# Altium schematic sheet Display.SchDoc: =SheetTitle
size A4; CompanyName: Catcatcat Electronics; Engineer: Hena Chernov; SheetNumber: 8; SheetTotal: 10; CodePhone: +380505759863; SheetDescription: Interactive light feedback module.; Email: catcatcat.electronics@gmail.com
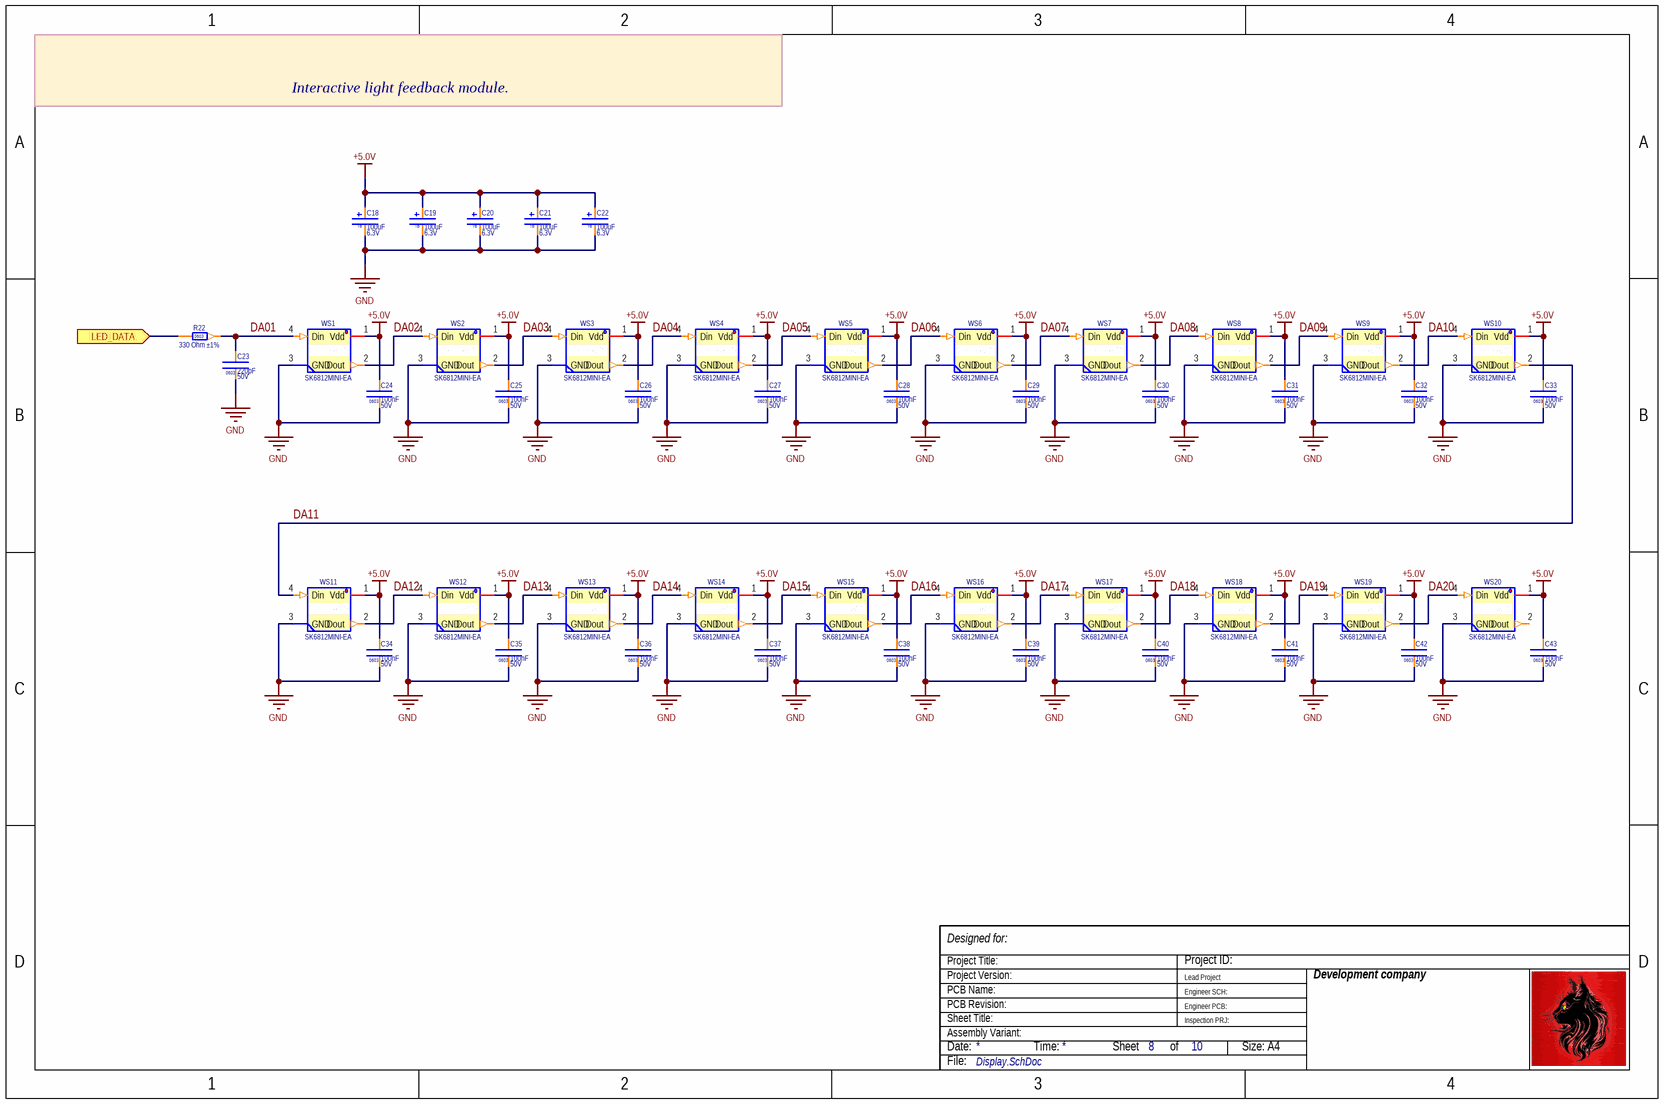
[diagram p0: Display.SchDoc]

## Parts
C18  value 100uF  Voltage: 6.3V  [TANTAL_B]  (hidden comment: 100UF 6.3V CASE-B_3528)
C19  value 100uF  Voltage: 6.3V  [TANTAL_B]  (hidden comment: 100UF 6.3V CASE-B_3528)
C20  value 100uF  Voltage: 6.3V  [TANTAL_B]  (hidden comment: 100UF 6.3V CASE-B_3528)
C21  value 100uF  Voltage: 6.3V  [TANTAL_B]  (hidden comment: 100UF 6.3V CASE-B_3528)
C22  value 100uF  Voltage: 6.3V  [TANTAL_B]  (hidden comment: 100UF 6.3V CASE-B_3528)
C23  value 220pF  Voltage: 50V  [CC0603(1608)x0.8]  (hidden comment: 220 pF ±10%)
C24  value 100nF  Voltage: 50V  [CC0603(1608)x0.8]  (hidden comment: 100 nF ±10% 50V)
C25  value 100nF  Voltage: 50V  [CC0603(1608)x0.8]  (hidden comment: 100 nF ±10% 50V)
C26  value 100nF  Voltage: 50V  [CC0603(1608)x0.8]  (hidden comment: 100 nF ±10% 50V)
C27  value 100nF  Voltage: 50V  [CC0603(1608)x0.8]  (hidden comment: 100 nF ±10% 50V)
C28  value 100nF  Voltage: 50V  [CC0603(1608)x0.8]  (hidden comment: 100 nF ±10% 50V)
C29  value 100nF  Voltage: 50V  [CC0603(1608)x0.8]  (hidden comment: 100 nF ±10% 50V)
C30  value 100nF  Voltage: 50V  [CC0603(1608)x0.8]  (hidden comment: 100 nF ±10% 50V)
C31  value 100nF  Voltage: 50V  [CC0603(1608)x0.8]  (hidden comment: 100 nF ±10% 50V)
C32  value 100nF  Voltage: 50V  [CC0603(1608)x0.8]  (hidden comment: 100 nF ±10% 50V)
C33  value 100nF  Voltage: 50V  [CC0603(1608)x0.8]  (hidden comment: 100 nF ±10% 50V)
C34  value 100nF  Voltage: 50V  [CC0603(1608)x0.8]  (hidden comment: 100 nF ±10% 50V)
C35  value 100nF  Voltage: 50V  [CC0603(1608)x0.8]  (hidden comment: 100 nF ±10% 50V)
C36  value 100nF  Voltage: 50V  [CC0603(1608)x0.8]  (hidden comment: 100 nF ±10% 50V)
C37  value 100nF  Voltage: 50V  [CC0603(1608)x0.8]  (hidden comment: 100 nF ±10% 50V)
C38  value 100nF  Voltage: 50V  [CC0603(1608)x0.8]  (hidden comment: 100 nF ±10% 50V)
C39  value 100nF  Voltage: 50V  [CC0603(1608)x0.8]  (hidden comment: 100 nF ±10% 50V)
C40  value 100nF  Voltage: 50V  [CC0603(1608)x0.8]  (hidden comment: 100 nF ±10% 50V)
C41  value 100nF  Voltage: 50V  [CC0603(1608)x0.8]  (hidden comment: 100 nF ±10% 50V)
C42  value 100nF  Voltage: 50V  [CC0603(1608)x0.8]  (hidden comment: 100 nF ±10% 50V)
C43  value 100nF  Voltage: 50V  [CC0603(1608)x0.8]  (hidden comment: 100 nF ±10% 50V)
R22  value 330 Ohm ±1%  [RC0603(1608) -1%]  (hidden comment: 330 R ±1%)
WS1  SK6812MINI-EA  [SK6812MINI-EA - 1MM]
WS2  SK6812MINI-EA  [SK6812MINI-EA - 1MM]
WS3  SK6812MINI-EA  [SK6812MINI-EA - 1MM]
WS4  SK6812MINI-EA  [SK6812MINI-EA - 1MM]
WS5  SK6812MINI-EA  [SK6812MINI-EA - 1MM]
WS6  SK6812MINI-EA  [SK6812MINI-EA - 1MM]
WS7  SK6812MINI-EA  [SK6812MINI-EA - 1MM]
WS8  SK6812MINI-EA  [SK6812MINI-EA - 1MM]
WS9  SK6812MINI-EA  [SK6812MINI-EA - 1MM]
WS10  SK6812MINI-EA  [SK6812MINI-EA - 1MM]
WS11  SK6812MINI-EA  [SK6812MINI-EA - 1MM]
WS12  SK6812MINI-EA  [SK6812MINI-EA - 1MM]
WS13  SK6812MINI-EA  [SK6812MINI-EA - 1MM]
WS14  SK6812MINI-EA  [SK6812MINI-EA - 1MM]
WS15  SK6812MINI-EA  [SK6812MINI-EA - 1MM]
WS16  SK6812MINI-EA  [SK6812MINI-EA - 1MM]
WS17  SK6812MINI-EA  [SK6812MINI-EA - 1MM]
WS18  SK6812MINI-EA  [SK6812MINI-EA - 1MM]
WS19  SK6812MINI-EA  [SK6812MINI-EA - 1MM]
WS20  SK6812MINI-EA  [SK6812MINI-EA - 1MM]

## Ports
LED_DATA (in)

## Nets
+5.0V: C18.1 C19.1 C20.1 C21.1 C22.1 C24.2 C25.2 C26.2 C27.2 C28.2 C29.2 C30.2 C31.2 C32.2 C33.2 C34.2 C35.2 C36.2 C37.2 C38.2 C39.2 C40.2 C41.2 C42.2 C43.2 WS1.1(Vdd) WS2.1(Vdd) WS3.1(Vdd) WS4.1(Vdd) WS5.1(Vdd) WS6.1(Vdd) WS7.1(Vdd) WS8.1(Vdd) WS9.1(Vdd) WS10.1(Vdd) WS11.1(Vdd) WS12.1(Vdd) WS13.1(Vdd) WS14.1(Vdd) WS15.1(Vdd) WS16.1(Vdd) WS17.1(Vdd) WS18.1(Vdd) WS19.1(Vdd) WS20.1(Vdd)
GND: C18.2 C19.2 C20.2 C21.2 C22.2 C23.1 C24.1 C25.1 C26.1 C27.1 C28.1 C29.1 C30.1 C31.1 C32.1 C33.1 C34.1 C35.1 C36.1 C37.1 C38.1 C39.1 C40.1 C41.1 C42.1 C43.1 WS1.3(GND) WS2.3(GND) WS3.3(GND) WS4.3(GND) WS5.3(GND) WS6.3(GND) WS7.3(GND) WS8.3(GND) WS9.3(GND) WS10.3(GND) WS11.3(GND) WS12.3(GND) WS13.3(GND) WS14.3(GND) WS15.3(GND) WS16.3(GND) WS17.3(GND) WS18.3(GND) WS19.3(GND) WS20.3(GND)
DA01: C23.2 R22.2 WS1.4(Din)
DA02: WS1.2(Dout) WS2.4(Din)
DA03: WS2.2(Dout) WS3.4(Din)
DA04: WS3.2(Dout) WS4.4(Din)
DA05: WS4.2(Dout) WS5.4(Din)
DA06: WS5.2(Dout) WS6.4(Din)
DA07: WS6.2(Dout) WS7.4(Din)
DA08: WS7.2(Dout) WS8.4(Din)
DA09: WS8.2(Dout) WS9.4(Din)
DA10: WS9.2(Dout) WS10.4(Din)
DA11: WS10.2(Dout) WS11.4(Din)
DA12: WS11.2(Dout) WS12.4(Din)
DA13: WS12.2(Dout) WS13.4(Din)
DA14: WS13.2(Dout) WS14.4(Din)
DA15: WS14.2(Dout) WS15.4(Din)
DA16: WS15.2(Dout) WS16.4(Din)
DA17: WS16.2(Dout) WS17.4(Din)
DA18: WS17.2(Dout) WS18.4(Din)
DA19: WS18.2(Dout) WS19.4(Din)
DA20: WS19.2(Dout) WS20.4(Din)
LED_DATA: R22.1 ; port LED_DATA

Not connected (* = marked no-connect by the designer): WS20 2(Dout)

## Notes on the sheet
- Project Title:
- Project Version:
- Designed for:
- Lead Project
- Project ID:
- Development company
- Date:
- PCB Revision:
- PCB Name:
- Sheet Title:
- Assembly Variant:
- Time:
- Sheet
- of
- Engineer SCH:
- Engineer PCB:
- Inspection PRJ:
- Size: A4
- File:
- (in symbol TANTAL-B 100uF 6.3V (B)) TB

## Library data of the parts
C18-C22 = TANTAL-B 100uF 6.3V (B): Tantalum Capacitors 100uF 6.3V CASE-B_3528 RoHS; Manufacturer 1: AVX; Manufacturer Part Number 1: TAJB107K006RNJ; Lifetime @ Temp: 2000Hrs@105℃; Case/Package: CASE-B_3528; Publisher: Catcatcat Electronics; Note: Tantalum Capacitors; HelpURL: https://datasheet.lcsc.com/szlcsc/AVX-TAJB107K006RNJ_C16133.pdf; website developer: http://catcatcat.d-lan.dp.ua/; Detailed Description: Tantalum Capacitors 100uF 6.3V CASE-B_3528 RoHS; Supplier URL 1: https://jlcpcb.com/parts/componentSearch?searchTxt=; Supplier Part Number 1: C16133; Supplier Unit Price 1: 0.1177; Assembly type: Basic Part; Footprint check status: Verified; QuantityElements: 1; Supplier 1: LCSC; MountType: SMD
C23 = 0603 0.000220 uF (B): 220 pF ±10% 50V X7R; Manufacturer 1: Samsung Electro-Mechanics; Manufacturer Part Number 1: CL10B221KB8NNNC; Note: Ceramic Capacitors; Detailed Description: 50V 220pF X7R ±10% 0603  Multilayer Ceramic Capacitors MLCC - SMD/SMT ROHS; Case/Package: 0603; Publisher: Catcatcat Electronics; Tolerance: ±10%; HelpURL: https://datasheet.lcsc.com/lcsc/1810261515_Samsung-Electro-Mechanics-CL10B221KB8NNNC_C1603.pdf; website developer: http://catcatcat.d-lan.dp.ua/; Temperature Coefficient: X7R; Supplier URL 1: https://jlcpcb.com/parts/componentSearch?searchTxt=; Operating Temperature: -55C to +125C; Supplier Part Number 1: C1603; Supplier Unit Price 1: 0.0074; Assembly type: Basic Part; Footprint check status: Verified; QuantityElements: 1; Supplier 1: LCSC; MountType: SMD
C24-C43 = 0603 0.1 uF (B): 100 nF ±10% 50V X7R; Manufacturer 1: YAGEO; Manufacturer Part Number 1: CC0603KRX7R9BB104; Note: Ceramic Capacitors; Detailed Description: 50V 100nF X7R ±10% 0603  Multilayer Ceramic Capacitors MLCC - SMD/SMT ROHS; Case/Package: 0603; Publisher: Catcatcat Electronics; Tolerance: ±10%; HelpURL: https://datasheet.lcsc.com/lcsc/1809301912_YAGEO-CC0603KRX7R9BB104_C14663.pdf; website developer: http://catcatcat.d-lan.dp.ua/; Temperature Coefficient: X7R; Supplier URL 1: https://jlcpcb.com/parts/componentSearch?searchTxt=; Operating Temperature: -55C to +125C; Supplier Part Number 1: C14663; Supplier Unit Price 1: 0.0021; Assembly type: Basic Part; Footprint check status: Verified; QuantityElements: 1; Supplier 1: LCSC; MountType: SMD
R22 = 0603 330 Ohm ±1% (B): 330 R (331) ±5% 1/10W 50V; Manufacturer 1: Uniroyal Elec; Manufacturer Part Number 1: 0603WAF3300T5E; Note: Chip Resistor - Surface Mount; Temperature Coefficient: ±100ppm/°C; Detailed Description: CHIP RESISTOR - SURFACE MOUNT 330OHMS ±1% 1/10W 0603 ROHS; Publisher: Catcatcat Electronics; Tolerance: ±1%; Voltage: 50V; HelpURL: https://datasheet.lcsc.com/szlcsc/Uniroyal-Elec-0603WAF3300T5E_C23138.pdf; Website Developer: http://catcatcat.d-lan.dp.ua/; Power (Watts): 1/10W; Supplier URL 1: https://jlcpcb.com/parts/componentSearch?searchTxt=; Manufacturer URL: http://uniohm.com/; Operating Temperature: -55°C ~ 155°C; Supplier Part Number 1: C23138; Supplier Unit Price 1: 0.0019; Assembly type: Basic Part; Footprint check status: Verified; QuantityElements: 1; Supplier 1: LCSC; MountType: SMD; Case/Package: 0603
WS1-WS20 = SK6812MINI-EA (E): TTB 12mA 5.2V -40℃~+80℃ RGB LEDs(Built-in IC); Manufacturer 1: OPSCO Optoelectronics; Note: IN THE HOLE OF THE PCB; Temp.Characteristic: -40C to +85C; Voltage: +3.7~+5.3V; Detailed Description: 12mA 5.2V -40℃~+80℃ RGB SMD  Light Emitting Diodes (LED) ROHS; Data Protocol: NRZ; Data structure: GRB 24bit; Case/Package: SMD; Publisher: Catcatcat Electronics; Manufacturer Part Number 1: SK6812MINI-EA; Supplier Part Number 1: C5378731; Supplier Unit Price 1: 0.1573; HelpURL: https://datasheet.lcsc.com/lcsc/2304101800_OPSCO-Optoelectronics-SK6812MINI-EA_C5378731.pdf; Website developer: http://catcatcat.d-lan.dp.ua/; Assembly type: Extended Part; Supplier URL 1: https://www.lcsc.com/product-detail/Light-Emitting-Diodes-LED_OPSCO-Optoelectronics-SK6812MINI-EA_C5378731.html; Footprint check status: Verified; QuantityElements: 1; Supplier 1: LCSC; Value: SK6812MINI-EA; MountType: SMD